# EAGLE schematic Pi MCU shield (EAGLE 7.6.0)
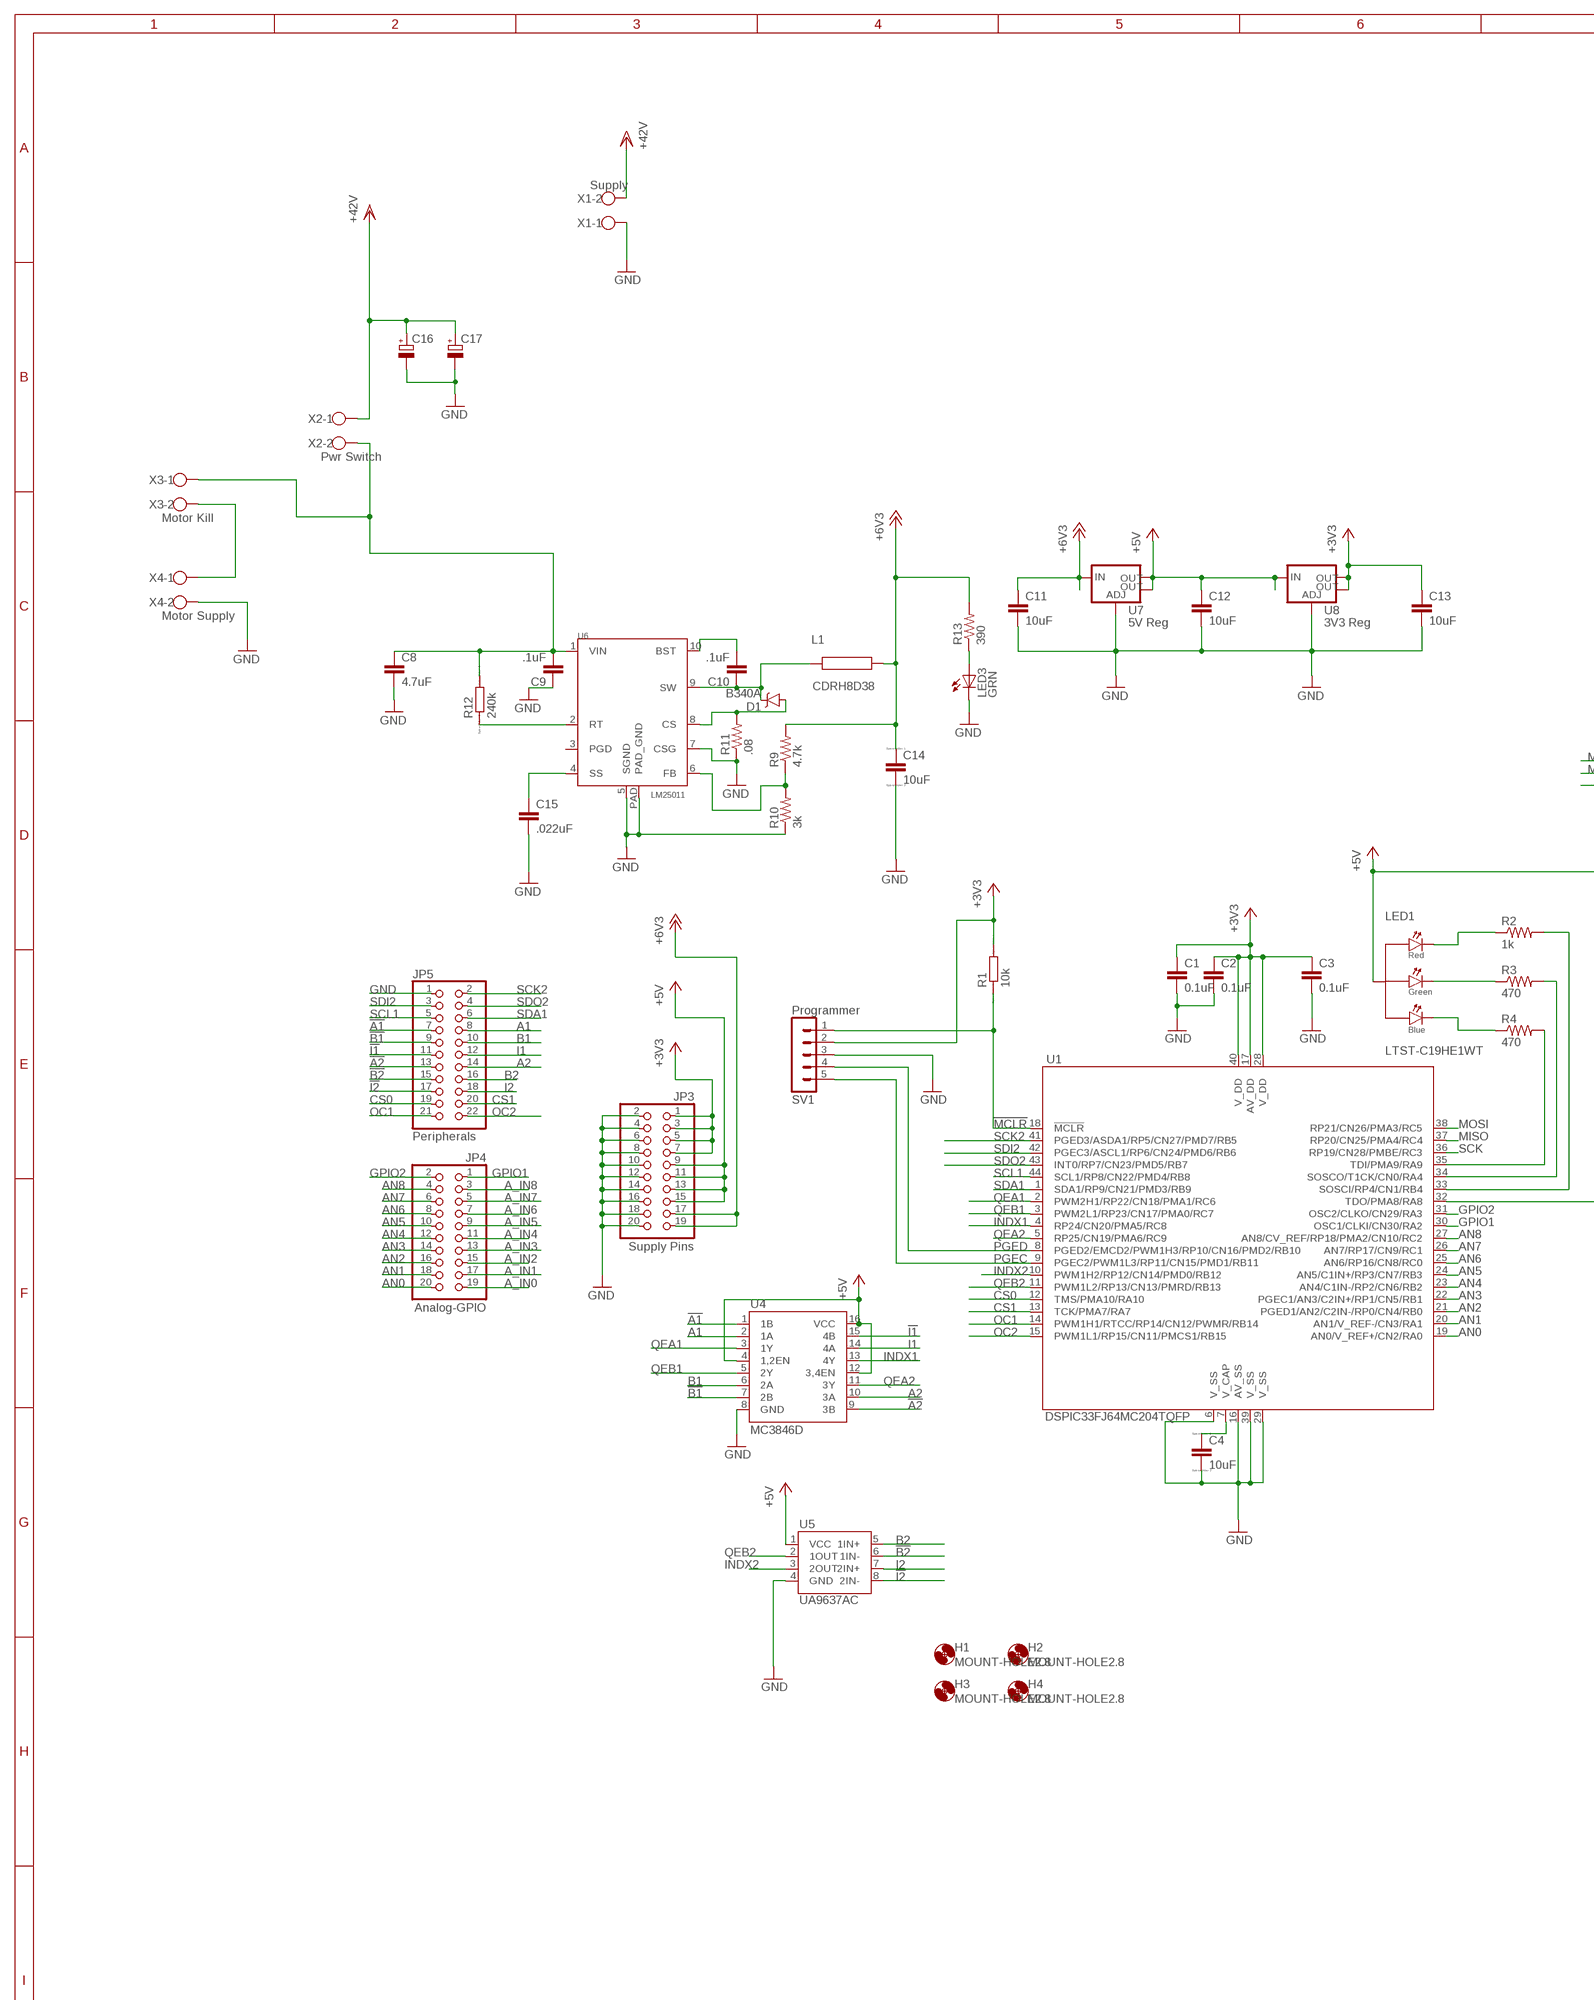
[diagram p0: schematic, sheet 1, part 1 of 2]
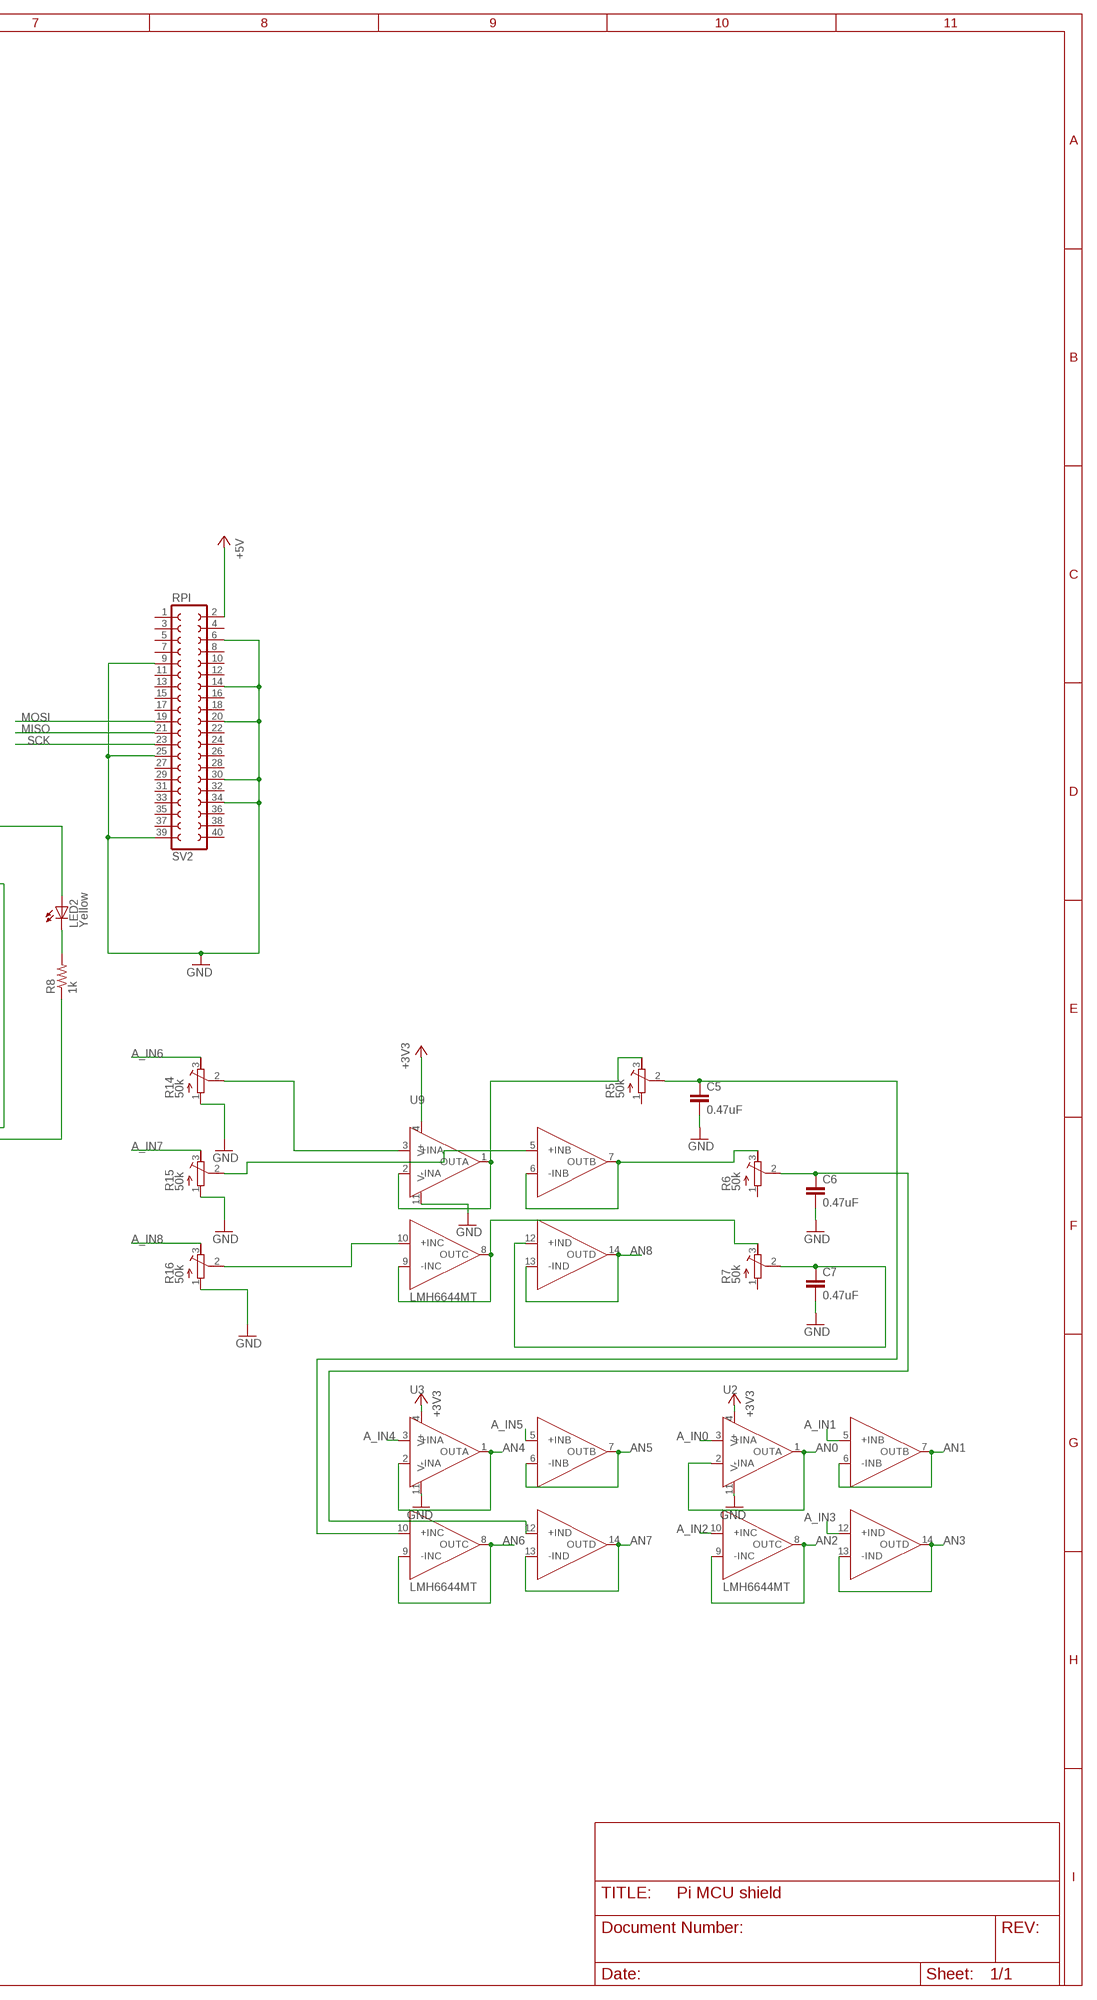
[diagram p1: schematic, sheet 1, part 2 of 2]

## Parts
C1  0.1uF  C-EUC0603  [C0603]
C2  0.1uF  C-EUC0603  [C0603]
C3  0.1uF  C-EUC0603  [C0603]
C4  10uF  CC1206  [C1206]
C5  0.47uF  C-EUC0603  [C0603]
C6  0.47uF  C-EUC0603  [C0603]
C7  0.47uF  C-EUC0603  [C0603]
C8  4.7uF  C-EUC1210  [C1210]
C9  .1uF  CAP0603-CAP  [0603-CAP]
C10  .1uF  CAP0603-CAP  [0603-CAP]
C11  10uF  C-EUC0805  [C0805]
C12  10uF  C-EUC0805  [C0805]
C13  10uF  C-EUC0805  [C0805]
C14  10uF  CC1206  [C1206]
C15  .022uF  CAP0603-CAP  [0603-CAP]
C16  CPOL-EUE5-13  [E5-13]
C17  CPOL-EUE5-13  [E5-13]
D1  B340A  DIODE-SCHOTTKY-B340A  [SMA-DIODE]
H1  MOUNT-HOLE2.8  [2,8]
H2  MOUNT-HOLE2.8  [2,8]
H3  MOUNT-HOLE2.8  [2,8]
H4  MOUNT-HOLE2.8  [2,8]
JP3  Supply Pins  PINHD-2X10  [2X10]
JP4  Analog-GPIO  PINHD-2X10  [2X10]
JP5  Peripherals  PINHD-2X11  [2X11]
L1  CDRH8D38  [CDRH8D38]
LED1  LTST-C19HE1WT  [0606]
LED2  Yellow  LEDSML0603  [SML0603]
LED3  GRN  LEDCHIP-LED0805  [CHIP-LED0805]
R1  10k  R  [R0805]
R2  1k  R-US_R0603  [R0603]
R3  470  R-US_R0603  [R0603]
R4  470  R-US_R0603  [R0603]
R5  50k  R-TRIMM3224J  [RTRIM3224J]
R6  50k  R-TRIMM3224J  [RTRIM3224J]
R7  50k  R-TRIMM3224J  [RTRIM3224J]
R8  1k  R-US_R0603  [R0603]
R9  4.7k  RESISTOR0603-RES  [0603-RES]
R10  3k  RESISTOR0603-RES  [0603-RES]
R11  .08  RESISTOR0603-RES  [0603-RES]
R12  240k  R  [R0805]
R13  390  RESISTOR0603-RES  [0603-RES]
R14  50k  R-TRIMM3224J  [RTRIM3224J]
R15  50k  R-TRIMM3224J  [RTRIM3224J]
R16  50k  R-TRIMM3224J  [RTRIM3224J]
SV1  Programmer  MA05-1  [MA05-1]
SV2  RPI  FE20-2  [FE20-2]
U1  DSPIC33FJ64MC204TQFP  [TQFP44]
U2  LMH6644MT  [TSSOP14]
U3  LMH6644MT  [TSSOP14]
U4  MC3846D  [SO-16]
U5  UA9637AC  [SO-08]
U6  LM25011  [HVSS0P-10]
U7  5V Reg  V_REG_LM1117SOT223  [SOT223]
U8  3V3 Reg  V_REG_LM1117SOT223  [SOT223]
U9  LMH6644MT  [TSSOP14]
X1  Supply  W237-102  [W237-102]
X2  Pwr Switch  W237-102  [W237-102]
X3  Motor Kill  W237-102  [W237-102]
X4  Motor Supply  W237-102  [W237-102]

## Nets
!A1: JP5.7 U4.1(1B)
!A2: JP5.13 U4.9(3B)
!B1: JP5.9 U4.7(2B)
!B2: JP5.15 U5.6(1IN-)
!I1: JP5.11 U4.15(4B)
!I2: JP5.17 U5.8(2IN-)
!MCLR: R1.1 SV1.1 U1.18(!MCLR)
+3V3: C1.1 C2.1 C3.1 C13.1 JP3.1 JP3.3 JP3.5 JP3.7 R1.2 SV1.2 U1.17(AV_DD) U1.28(V_DD) U1.40(V_DD) U2.4(V+) U3.4(V+) U8.2(OUT) U8.4(OUT) U9.4(V+)
+5V: C12.1 JP3.9 JP3.11 JP3.13 JP3.15 LED1.4(ANODE) LED2.A SV2.2 U4.4(1,2EN) U4.12(3,4EN) U4.16(VCC) U5.1(VCC) U7.2(OUT) U7.4(OUT) U8.3(IN)
+6V3: C11.1 C14.1 JP3.17 JP3.19 L1.P$2 R9.2 R13.2 U7.3(IN)
A1: JP5.8 U4.2(1A)
A2: JP5.14 U4.10(3A)
A_IN0: JP4.19 U2.3(+INA)
A_IN1: JP4.17 U2.5(+INB)
A_IN2: JP4.15 U2.10(+INC)
A_IN3: JP4.13 U2.12(+IND)
A_IN4: JP4.11 U3.3(+INA)
A_IN5: JP4.9 U3.5(+INB)
A_IN6: JP4.7 R14.3(E)
A_IN7: JP4.5 R15.3(E)
A_IN8: JP4.3 R16.3(E)
AN0: JP4.20 U1.19(AN0/V_REF+/CN2/RA0) U2.1(OUTA) U2.2(-INA)
AN1: JP4.18 U1.20(AN1/V_REF-/CN3/RA1) U2.6(-INB) U2.7(OUTB)
AN2: JP4.16 U1.21(PGED1/AN2/C2IN-/RP0/CN4/RB0) U2.8(OUTC) U2.9(-INC)
AN3: JP4.14 U1.22(PGEC1/AN3/C2IN+/RP1/CN5/RB1) U2.13(-IND) U2.14(OUTD)
AN4: JP4.12 U1.23(AN4/C1IN-/RP2/CN6/RB2) U3.1(OUTA) U3.2(-INA)
AN5: JP4.10 U1.24(AN5/C1IN+/RP3/CN7/RB3) U3.6(-INB) U3.7(OUTB)
AN6: JP4.8 U1.25(AN6/RP16/CN8/RC0) U3.8(OUTC) U3.9(-INC)
AN7: JP4.6 U1.26(AN7/RP17/CN9/RC1) U3.13(-IND) U3.14(OUTD)
AN8: JP4.4 U1.27(AN8/CV_REF/RP18/PMA2/CN10/RC2) U9.13(-IND) U9.14(OUTD)
B1: JP5.10 U4.6(2A)
B2: JP5.16 U5.5(1IN+)
BLUE: LED1.2(G_CATHODE) R3.1
CS0: JP5.19 U1.12(TMS/PMA10/RA10)
CS1: JP5.20 U1.13(TCK/PMA7/RA7)
GND: C1.2 C2.2 C3.2 C4.2 C5.2 C6.2 C7.2 C8.2 C9.1 C11.2 C12.2 C13.2 C14.2 C15.2 C16.- C17.- JP3.2 JP3.4 JP3.6 JP3.8 JP3.10 JP3.12 JP3.14 JP3.16 JP3.18 JP3.20 JP5.1 LED3.C R10.1 R11.1 R14.1(A) R15.1(A) R16.1(A) SV1.3 SV2.6 SV2.9 SV2.14 SV2.20 SV2.25 SV2.30 SV2.34 SV2.39 U1.6(V_SS) U1.16(AV_SS) U1.29(V_SS) U1.39(V_SS) U2.11(V-) U3.11(V-) U4.8(GND) U5.4(GND) U6.5(SGND) U6.7(CSG) U6.PAD(PAD_GND) U7.1(ADJ) U8.1(ADJ) U9.11(V-) X1.1 X4.2
GPIO1: JP4.1 U1.30(OSC1/CLKI/CN30/RA2)
GPIO2: JP4.2 U1.31(OSC2/CLKO/CN29/RA3)
GREEN: LED1.3(B_CATHODE) R4.1
I1: JP5.12 U4.14(4A)
I2: JP5.18 U5.7(2IN+)
INDX1: U1.4(RP24/CN20/PMA5/RC8) U4.13(4Y)
INDX2: U1.10(PWM1H2/RP12/CN14/PMD0/RB12) U5.3(2OUT)
MISO: SV2.21 U1.37(RP20/CN25/PMA4/RC4)
MOSI: SV2.19 U1.38(RP21/CN26/PMA3/RC5)
N$1: R15.2(S) U9.5(+INB)
N$2: C4.1 U1.7(V_CAP)
N$3: C8.1 C9.2 R12.2 U6.1(VIN) X2.2 X3.1
N$4: C7.1 R7.2(S) U9.12(+IND)
N$5: C5.1 R5.2(S) U3.10(+INC)
N$7: X3.2 X4.1
N$10: R14.2(S) U9.3(+INA)
N$16: R6.3(E) U9.6(-INB) U9.7(OUTB)
N$18: R7.3(E) U9.8(OUTC) U9.9(-INC)
N$23: LED3.A R13.1
N$25: LED2.C R8.2
N$28: R4.2 U1.35(TDI/PMA9/RA9)
N$29: R3.2 U1.34(SOSCO/T1CK/CN0/RA4)
N$30: R2.2 U1.33(SOSCI/RP4/CN1/RB4)
N$31: R16.2(S) U9.10(+INC)
N$32: R8.1 U1.32(TDO/PMA8/RA8)
N$33: C10.1 D1.C L1.P$1 U6.9(SW)
N$35: R9.1 R10.2 U6.6(FB)
N$36: R12.1 U6.2(RT)
N$37: C15.1 U6.4(SS)
N$38: D1.A R11.2 U6.8(CS)
N$39: C10.2 U6.10(BST)
N$44: R5.3(E) U9.1(OUTA) U9.2(-INA)
N$57: C6.1 R6.2(S) U3.12(+IND)
OC1: JP5.21 U1.14(PWM1H1/RTCC/RP14/CN12/PWMR/RB14)
OC2: JP5.22 U1.15(PWM1L1/RP15/CN11/PMCS1/RB15)
PGEC: SV1.5 U1.9(PGEC2/PWM1L3/RP11/CN15/PMD1/RB11)
PGED: SV1.4 U1.8(PGED2/EMCD2/PWM1H3/RP10/CN16/PMD2/RB10)
QEA1: U1.2(PWM2H1/RP22/CN18/PMA1/RC6) U4.3(1Y)
QEA2: U1.5(RP25/CN19/PMA6/RC9) U4.11(3Y)
QEB1: U1.3(PWM2L1/RP23/CN17/PMA0/RC7) U4.5(2Y)
QEB2: U1.11(PWM1L2/RP13/CN13/PMRD/RB13) U5.2(1OUT)
RED: LED1.1(R_CATHODE) R2.1
SCK: SV2.23 U1.36(RP19/CN28/PMBE/RC3)
SCK2: JP5.2 U1.41(PGED3/ASDA1/RP5/CN27/PMD7/RB5)
SCL1: JP5.5 U1.44(SCL1/RP8/CN22/PMD4/RB8)
SDA1: JP5.6 U1.1(SDA1/RP9/CN21/PMD3/RB9)
SDI2: JP5.3 U1.42(PGEC3/ASCL1/RP6/CN24/PMD6/RB6)
SDO2: JP5.4 U1.43(INT0/RP7/CN23/PMD5/RB7)
VDD: C16.+ C17.+ X1.2 X2.1 ; supply symbol labelled +42V
Unconnected: R5.1(A) R6.1(A) R7.1(A) SV2.1 SV2.3 SV2.4 SV2.5 SV2.7 SV2.8 SV2.10 SV2.11 SV2.12 SV2.13 SV2.15 SV2.16 SV2.17 SV2.18 SV2.22 SV2.24 SV2.26 SV2.27 SV2.28 SV2.29 SV2.31 SV2.32 SV2.33 SV2.35 SV2.36 SV2.37 SV2.38 SV2.40 U6.3(PGD)

## Library data of the parts
C1-C3 C5-C8 C11-C13 = resistor:C-EU: CAPACITOR, European symbol
C4 C14 = eagle-ltspice:C: CAPACITOR, European symbol; SPICEMODEL: NONE; SPICEPREFIX: C
C9 C10 C15 = SparkFun-Capacitors:CAP: Capacitor Standard 0603 ceramic capacitor, and 0.1" leaded capacitor.
C16 C17 = resistor:CPOL-EU: POLARIZED CAPACITOR, European symbol
D1 = SparkFun-DiscreteSemi:DIODE-SCHOTTKY: Schottky diodes in SFE's production catalog BAT20J 1A 23V 0.62Vf RB751 120mA 40V 0.37Vf PMEG4005EJ 0.5A 40V 0.42Vf MBRA140 1A 40V 0.5Vf B340A 3A 40V SMA; PROD_ID: DIO-09886
H1-H4 = holes:MOUNT-HOLE: MOUNTING HOLE with drill center marker
JP3 JP4 = pinhead:PINHD-2X10: PIN HEADER
JP5 = pinhead:PINHD-2X11: PIN HEADER
L1 = sumida:CDRH8D38: Power Inductor - 1.8uH to 100 uH, 4mm tall, shielded
LED1 = led:LTST-C19HE1WT: RGB LED, common cathode. Vf ~ 3.3V (B, G), 2.1V (R) at 20mA.
LED2 LED3 = led:LED: LED OSRAM: - CHIPLED LG R971, LG N971, LY N971, LG Q971, LY Q971, LO R971, LY R971 LH N974, LH R974 LS Q976, LO Q976, LY Q976 LO Q996 - Hyper CHIPLED LW Q18S LB Q993, LB Q99A, LB R99A - SideLED LS A670, LO A670, LY A670, LG A670, LP A670 LB A673, LV A673, LT A673, LW A673 LH A674 LY A675 LS A676, LA A676, LO A676, LY A676, LW A676 LS A679, LY A679, LG A679 - Hyper Micro SIDELED® LS Y876, LA Y876, LO Y876, LY Y876 LT Y87S - SmartLED LW L88C, LW L88S LB L89C, LB L89S, LG L890 LS L89K, LO L89K, LY L89K LS L896, LA L896, LO L896, LY L896 - TOPLED LS T670, LO T670, LY T670, LG T670, LP T670 LSG T670, LSP T670, LSY T670, LOP T670, LYG T670 LG T671, LOG T671, LSG T671 LB T673, LV T673, LT T673, LW T673 LH T674 LS T676, LA T676, LO T676, LY T676, LB T676, LH T676, LSB T676, LW T676 LB T67C, LV T67C, LT T67C, LS T67K, LO T67K, LY T67K, LW E67C LS E67B, LA E67B, LO E67B, LY E67B, LB E67C, LV E67C, LT E67C LW T67C LS T679, LY T679, LG T679 LS T770, LO T770, LY T770, LG T770, LP T770 LB T773, LV T773, LT T773, LW T773 LH T774 LS E675, LA E675, LY E675, LS T675 LS T776, LA T776, LO T776, LY T776, LB T776 LHGB T686 LT T68C, LB T68C - Hyper Mini TOPLED® LB M676 - Mini TOPLED Santana® LG M470 LS M47K, LO M47K, LY M47K Source: http://www.osram.convergy.de LUXEON: - LUMILED® LXK2-PW12-R00, LXK2-PW12-S00, LXK2-PW14-U00, LXK2-PW14-V00 LXK2-PM12-R00, LXK2-PM12-S00, LXK2-PM14-U00 LXK2-PE12-Q00, LXK2-PE12-R00, LXK2-PE12-S00, LXK2-PE14-T00, LXK2-PE14-U00 LXK2-PB12-K00, LXK2-PB12-L00, LXK2-PB12-M00, LXK2-PB14-N00, LXK2-PB14-P00, LXK2-PB14-Q00 LXK2-PR12-L00, LXK2-PR12-M00, LXK2-PR14-Q00, LXK2-PR14-R00 LXK2-PD12-Q00, LXK2-PD12-R00, LXK2-PD12-S00 LXK2-PH12-R00, LXK2-PH12-S00 LXK2-PL12-P00, LXK2-PL12-Q00, LXK2-PL12-R00 Source: www.luxeon.com KINGBRIGHT: KA-3528ASYC Source: www.kingbright.com
R1 R12 = eagle-ltspice:R: RESISTOR, European symbol; SPICEMODEL: NONE; SPICEPREFIX: R
R2-R4 R8 = resistor:R-US_: RESISTOR, American symbol
R5-R7 R14-R16 = rcl:R-TRIMM: Trimm resistor
R9-R11 R13 = SparkFun-Resistors:RESISTOR: Resistor Basic schematic elements and footprints for 0603, 1206, and PTH resistors.
SV1 = con-lstb:MA05-1: PIN HEADER; OC_FARNELL: unknown; OC_NEWARK: unknown
SV2 = con-lsta:FE20-2: FEMALE HEADER; OC_FARNELL: unknown; OC_NEWARK: unknown
U1 = microchip:DSPIC33FJ64MC204: A 16-bit microcontroller/digital signal processor with 26 reprogrammable i/o pins,35 total i/o pins, and support for encoders, pwm output (output compare), input capture, SPI/I2C/UART serial communication, and 9 ADC channels.
U2 U3 U9 = texas:LMH6644: Fast op amps for ADC buffering. 130 MHz, full power bandwidth 40MHz, 130V/us slew rate.
U4 = texas:MC3846: Quadruple differential line receiver. 5V supply, 3 state output.
U5 = texas:UA9637AC: Dual differential line receiver, 5V supply, 8 pins.
U6 = SparkFun-PowerIC:LM25011: The LM25011 constant on-time step-down switching regulator features all the functions needed to implement a low-cost, efficient, buck bias regulator capable of supplying up to 2 A of load current. This high-voltage regulator contains an N-Channel Buck switch, a startup regulator, current limit detection, and internal ripple control.; PROD_ID: IC-12528
U7 U8 = SparkFun-PowerIC:V_REG_LM1117: Voltage Regulator LM1117 Standard adjustable voltage regulator but in SMD form. Spark Fun Electronics SKU : COM-00595; PROD_ID: VREG-08170
X1-X4 = con-wago-500:W237-102: WAGO SCREW CLAMP; MPN: 237-102; OC_FARNELL: unknown; OC_NEWARK: 70K9898